# EAGLE design ESP8266_Single_RGB_RevB (EAGLE 9.6.2)
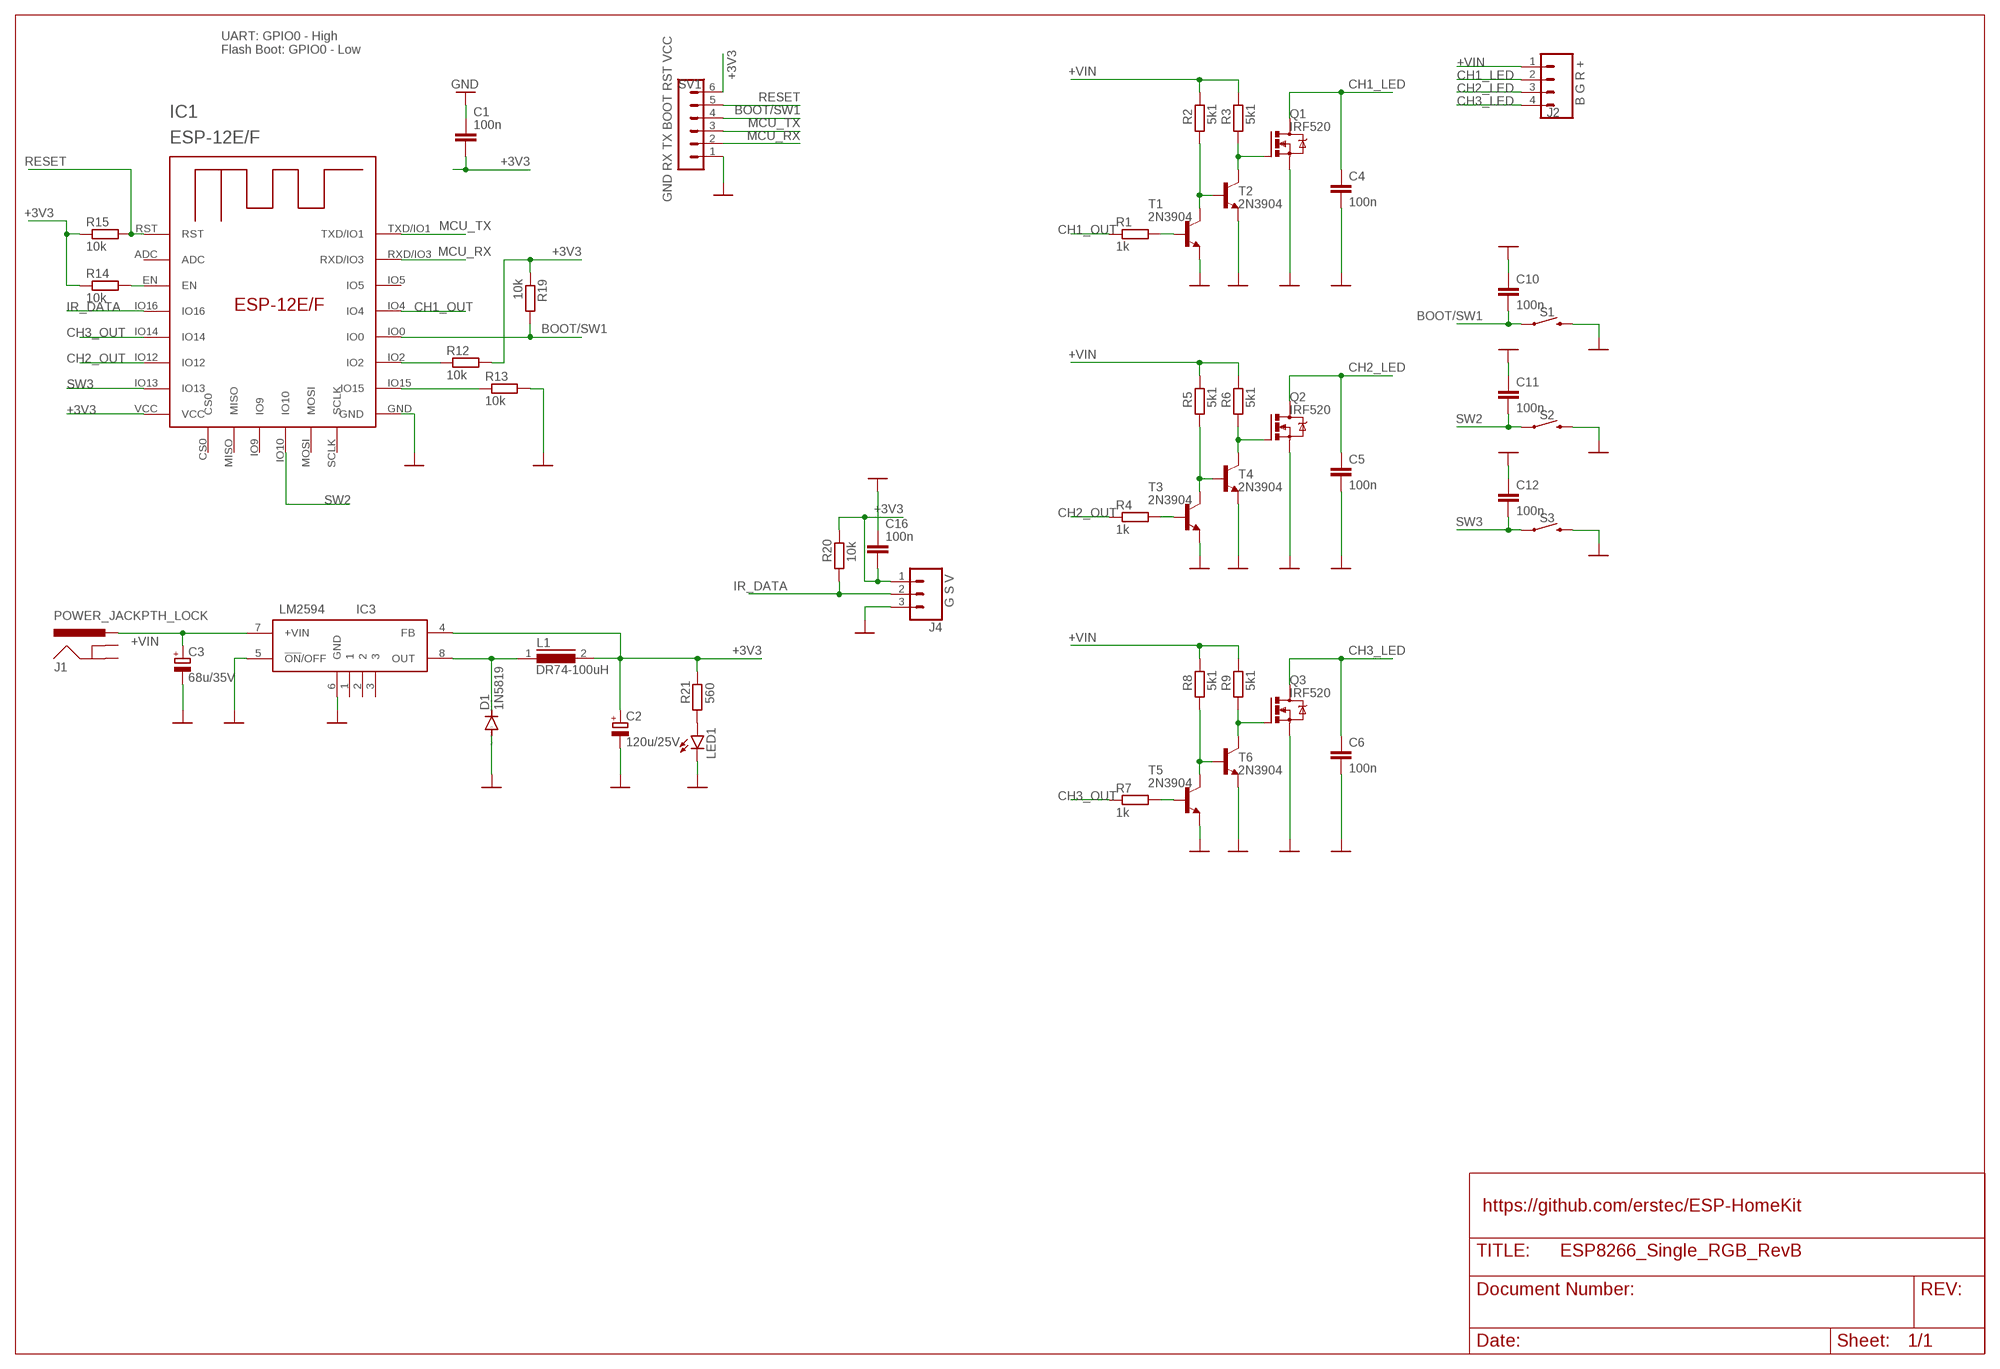
[diagram p0: schematic, sheet 1]

## Parts
C1  100n  C-EU050-024X044  [C050-024X044]
C2  120u/25V  CPOL-EUE2,5-6E  [E2,5-6E]
C3  68u/35V  CPOL-EUE2.5-6  [E2,5-6]
C4  100n  C-EU050-024X044  [C050-024X044]
C5  100n  C-EU050-024X044  [C050-024X044]
C6  100n  C-EU050-024X044  [C050-024X044]
C10  100n  C-EU050-024X044  [C050-024X044]
C11  100n  C-EU050-024X044  [C050-024X044]
C12  100n  C-EU050-024X044  [C050-024X044]
C16  100n  C-EU050-024X044  [C050-024X044]
D1  1N5819  DIODE-DO41-7.6  [DO41-7.6]
IC1  ESP-12E/F  [ESP-12E]
IC3  LM2594  [TSOP8]
J1  POWER_JACKPTH_LOCK  [POWER_JACK_PTH_LOCK]
J2  B G R +  CONN_04SCREW_LOCK  [SCREWTERMINAL-3.5MM-4_LOCK]
J4  G S V  CONN_03SCREW_LOCK  [SCREWTERMINAL-3.5MM-3_LOCK.007S]
L1  DR74-100uH  DR74  [DR74]
LED1  LED5MM  [LED5MM]
Q1  IRF520  [TO220BV]
Q2  IRF520  [TO220BV]
Q3  IRF520  [TO220BV]
R1  1k  R-EU_0204/7  [0204/7]
R2  5k1  R-EU_0204/7  [0204/7]
R3  5k1  R-EU_0204/7  [0204/7]
R4  1k  R-EU_0204/7  [0204/7]
R5  5k1  R-EU_0204/7  [0204/7]
R6  5k1  R-EU_0204/7  [0204/7]
R7  1k  R-EU_0204/7  [0204/7]
R8  5k1  R-EU_0204/7  [0204/7]
R9  5k1  R-EU_0204/7  [0204/7]
R12  10k  R-EU_0204/7  [0204/7]
R13  10k  R-EU_0204/7  [0204/7]
R14  10k  R-EU_0204/7  [0204/7]
R15  10k  R-EU_0204/7  [0204/7]
R19  10k  R-EU_0204/7  [0204/7]
R20  10k  R-EU_0204/7  [0204/7]
R21  560  R-EU_0204/7  [0204/7]
S1  MOMENTARY-SWITCH-SPST-PTH-6.0MM  [TACTILE_SWITCH_PTH_6.0MM]
S2  MOMENTARY-SWITCH-SPST-PTH-6.0MM  [TACTILE_SWITCH_PTH_6.0MM]
S3  MOMENTARY-SWITCH-SPST-PTH-6.0MM  [TACTILE_SWITCH_PTH_6.0MM]
SV1  GND RX TX BOOT RST VCC  MA06-1  [MA06-1]
T1  2N3904  2N3904-NPN-TO92-EBC  [TO92-EBC]
T2  2N3904  2N3904-NPN-TO92-EBC  [TO92-EBC]
T3  2N3904  2N3904-NPN-TO92-EBC  [TO92-EBC]
T4  2N3904  2N3904-NPN-TO92-EBC  [TO92-EBC]
T5  2N3904  2N3904-NPN-TO92-EBC  [TO92-EBC]
T6  2N3904  2N3904-NPN-TO92-EBC  [TO92-EBC]

## Nets
+3V3: C1.2 C2.+ C16.2 IC1.VCC IC3.4(FB) J4.1 L1.2 R12.2 R14.1 R15.1 R19.1 R20.2 R21.2 SV1.6
+VIN: C3.+ IC3.7(+VIN) J1.PWR J2.1 R2.2 R3.2 R5.2 R6.2 R8.2 R9.2
BOOT/SW1: C10.2 IC1.IO0 R19.2 S1.1 SV1.4
CH1_LED: C4.1 J2.2 Q1.D
CH1_OUT: IC1.IO4 R1.1
CH2_LED: C5.1 J2.3 Q2.D
CH2_OUT: IC1.IO12 R4.1
CH3_LED: C6.1 J2.4 Q3.D
CH3_OUT: IC1.IO14 R7.1
GND: C1.1 C2.- C3.- C4.2 C5.2 C6.2 C10.1 C11.1 C12.1 C16.1 D1.A IC1.GND IC3.5(!ON!/OFF) IC3.6(GND) J4.3 LED1.K(C) Q1.S Q2.S Q3.S R13.2 S1.3 S2.3 S3.3 SV1.1 T1.E T2.E T3.E T4.E T5.E T6.E
IR_DATA: IC1.IO16 J4.2 R20.1
MCU_RX: IC1.RXD/IO3 SV1.2
MCU_TX: IC1.TXD/IO1 SV1.3
N$1: R2.1 T1.C T2.B
N$2: R1.2 T1.B
N$3: LED1.A R21.1
N$4: Q1.G R3.1 T2.C
N$10: R5.1 T3.C T4.B
N$11: R4.2 T3.B
N$13: Q2.G R6.1 T4.C
N$15: D1.C IC3.8(OUT) L1.1
N$16: R8.1 T5.C T6.B
N$17: R7.2 T5.B
N$19: Q3.G R9.1 T6.C
N$71: IC1.IO2 R12.1
N$72: IC1.IO15 R13.1
N$74: IC1.EN R14.2
RESET: IC1.RST R15.2 SV1.5
SW2: C11.2 IC1.IO10 S2.1
SW3: C12.2 IC1.IO13 S3.1
Unconnected: IC1.ADC IC1.CS0 IC1.IO5 IC1.IO9 IC1.MISO IC1.MOSI IC1.SCLK IC3.1 IC3.2 IC3.3 J1.GND J1.GNDBREAK

## Notes on the sheet
- UART: GPIO0 - High
  Flash Boot: GPIO0 - Low
- https://github.com/erstec/ESP-HomeKit

## Library data of the parts
C1 C4-C6 C10-C12 C16 = rcl:C-EU: CAPACITOR, European symbol; SPICEPREFIX: C
C2 C3 = rcl:CPOL-EU: POLARIZED CAPACITOR, European symbol; SPICEPREFIX: C
D1 = diode:DIODE-: DIODE
IC1 = esp-12e-f:ESP-12E/F
IC3 = LM2594:LM2594: Power Converter 150kHz 0.5A Step-Down Voltage Regulator Check availability <https://pricing.snapeda.com/parts/LM2594/National%20Semiconductor/view-part?ref=eda>; AVAILABILITY: Not in stock; DESCRIPTION: Buck Switching Regulator IC Positive Adjustable 1.2V 1 Output 500mA 8-SOIC (0.154, 3.90mm Width); MF: National Semiconductor; MP: LM2594; PACKAGE: SOIC-8 National Semiconductor; PRICE: None
J1 = SparkFun-Connectors:POWER_JACK: Power Jack Connector This is the standard 5.5mm barrel jack for power. The PTH is the most common, proven, reliable, footprint. The Slot footprint only works if the mill layer is transmitted to the PCB fab house so be warned. Here are the connectors we sell at SparkFun: DC Barrel Power Jack/Connector <https://www.sparkfun.com/products/119> (PRT-00119) DC Barrel Power Jack/Connector (SMD) <https://www.sparkfun.com/products/12748> (PRT-12748) DC Barrel Jack Adapter - Breadboard Compatible <https://www.sparkfun.com/products/10811> (PRT-10811) It is used on this SparkFun product (and many, many others): SparkFun RedBoard - Programmed with Arduino <https://www.sparkfun.com/products/12757> (DEV-12757) Also, if you need a mating power supply or connector, please check these out: Wall Adapter Power Supply - 9VDC 650mA <https://www.sparkfun.com/products/298> (TOL-00298) DC Barrel Jack Adapter - Male <https://www.sparkfun.com/products/10287> (PRT-10287); PROD_ID: CONN-08197; SF_ID: PRT-00119
J2 = SparkFun-Connectors:CONN_04: Multi connection point. Often used as Generic Header-pin footprint for 0.1 inch spaced/style header connections On any of the 0.1 inch spaced packages, you can populate with these: Break Away Headers - Straight <https://www.sparkfun.com/products/116> (PRT-00116) Break Away Male Headers - Right Angle <https://www.sparkfun.com/products/553> (PRT-00553) Female Headers <https://www.sparkfun.com/products/115> (PRT-00115) Break Away Headers - Machine Pin <https://www.sparkfun.com/products/117> (PRT-00117) Break Away Female Headers - Swiss Machine Pin <https://www.sparkfun.com/products/743> (PRT-00743) For SCREWTERMINALS and SPRING TERMINALS visit here: Screw Terimnals on SparkFun.com <https://www.sparkfun.com/search/results?term=Screw+Terminals> (5mm/3.5mm/2.54mm spacing) This device is also useful as a general connection point to wire up your design to another part of your project. Our various solder wires solder well into these plated through hole pads. Hook-Up Wire - Assortment (Stranded, 22 AWG) <https://www.sparkfun.com/products/11375> (PRT-11375) Hook-Up Wire - Assortment (Solid Core, 22 AWG) <https://www.sparkfun.com/products/11367> (PRT-11367) View the entire wire category on our website here <https://www.sparkfun.com/categories/141> Special notes: Molex polarized connector foot print use with SKU : PRT-08231 with associated crimp pins and housings. 1MM SMD Version SKU: PRT-10208
J4 = SparkFun-Connectors:CONN_03: Multi connection point. Often used as Generic Header-pin footprint for 0.1 inch spaced/style header connections On any of the 0.1 inch spaced packages, you can populate with these: Break Away Headers - Straight <https://www.sparkfun.com/products/116> (PRT-00116) Break Away Male Headers - Right Angle <https://www.sparkfun.com/products/553> (PRT-00553) Female Headers <https://www.sparkfun.com/products/115> (PRT-00115) Break Away Headers - Machine Pin <https://www.sparkfun.com/products/117> (PRT-00117) Break Away Female Headers - Swiss Machine Pin <https://www.sparkfun.com/products/743> (PRT-00743) Stackable Header - 3 Pin (Female, 0.1") <https://www.sparkfun.com/products/13875> (PRT-13875) For SCREWTERMINALS and SPRING TERMINALS visit here: Screw Terimnals on SparkFun.com <https://www.sparkfun.com/search/results?term=Screw+Terminals> (5mm/3.5mm/2.54mm spacing) This device is also useful as a general connection point to wire up your design to another part of your project. Our various solder wires solder well into these plated through hole pads. Hook-Up Wire - Assortment (Stranded, 22 AWG) <https://www.sparkfun.com/products/11375> (PRT-11375) Hook-Up Wire - Assortment (Solid Core, 22 AWG) <https://www.sparkfun.com/products/11367> (PRT-11367) View the entire wire category on our website here <https://www.sparkfun.com/categories/141> Special notes: Molex polarized connector foot print use with SKU : PRT-08232 with associated crimp pins and housings.; PROD_ID: CONN-08288; SF_ID: PRT-08235
L1 = inductors:DR74: High Power Density, High Efficiency, Shielded Inductors Source: coiltronics_dr_series.pdf
LED1 = led:LED: LED OSRAM: - CHIPLED LG R971, LG N971, LY N971, LG Q971, LY Q971, LO R971, LY R971 LH N974, LH R974 LS Q976, LO Q976, LY Q976 LO Q996 - Hyper CHIPLED LW Q18S LB Q993, LB Q99A, LB R99A - SideLED LS A670, LO A670, LY A670, LG A670, LP A670 LB A673, LV A673, LT A673, LW A673 LH A674 LY A675 LS A676, LA A676, LO A676, LY A676, LW A676 LS A679, LY A679, LG A679 - Hyper Micro SIDELED® LS Y876, LA Y876, LO Y876, LY Y876 LT Y87S - SmartLED LW L88C, LW L88S LB L89C, LB L89S, LG L890 LS L89K, LO L89K, LY L89K LS L896, LA L896, LO L896, LY L896 - TOPLED LS T670, LO T670, LY T670, LG T670, LP T670 LSG T670, LSP T670, LSY T670, LOP T670, LYG T670 LG T671, LOG T671, LSG T671 LB T673, LV T673, LT T673, LW T673 LH T674 LS T676, LA T676, LO T676, LY T676, LB T676, LH T676, LSB T676, LW T676 LB T67C, LV T67C, LT T67C, LS T67K, LO T67K, LY T67K, LW E67C LS E67B, LA E67B, LO E67B, LY E67B, LB E67C, LV E67C, LT E67C LW T67C LS T679, LY T679, LG T679 LS T770, LO T770, LY T770, LG T770, LP T770 LB T773, LV T773, LT T773, LW T773 LH T774 LS E675, LA E675, LY E675, LS T675 LS T776, LA T776, LO T776, LY T776, LB T776 LHGB T686 LT T68C, LB T68C - Hyper Mini TOPLED® LB M676 - Mini TOPLED Santana® LG M470 LS M47K, LO M47K, LY M47K Source: http://www.osram.convergy.de LUXEON: - LUMILED® LXK2-PW12-R00, LXK2-PW12-S00, LXK2-PW14-U00, LXK2-PW14-V00 LXK2-PM12-R00, LXK2-PM12-S00, LXK2-PM14-U00 LXK2-PE12-Q00, LXK2-PE12-R00, LXK2-PE12-S00, LXK2-PE14-T00, LXK2-PE14-U00 LXK2-PB12-K00, LXK2-PB12-L00, LXK2-PB12-M00, LXK2-PB14-N00, LXK2-PB14-P00, LXK2-PB14-Q00 LXK2-PR12-L00, LXK2-PR12-M00, LXK2-PR14-Q00, LXK2-PR14-R00 LXK2-PD12-Q00, LXK2-PD12-R00, LXK2-PD12-S00 LXK2-PH12-R00, LXK2-PH12-S00 LXK2-PL12-P00, LXK2-PL12-Q00, LXK2-PL12-R00 Source: www.luxeon.com KINGBRIGHT: KA-3528ASYC Source: www.kingbright.com
Q1-Q3 = transistor-power:IRF520: HEXFET Power MOSFET
R1-R9 R12-R15 R19-R21 = rcl:R-EU_: RESISTOR, European symbol; SPICEPREFIX: R
S1-S3 = SparkFun-Switches:MOMENTARY-SWITCH-SPST: Momentary Switch (Pushbutton) - SPST Normally-open (NO) SPST momentary switches (buttons, pushbuttons). Variants PTH-12MM - 12mm square, through-hole Momentary Pushbutton Switch - 12mm Square <https://www.sparkfun.com/products/9190> (COM-09190) PTH-6.0MM, PTH-6.0MM-KIT - 6.0mm square, through-hole Mini Pushbutton Switch <https://www.sparkfun.com/products/97> (COM-00097) KIT package intended for soldering kit's - only one side of pads' copper is exposed. PTH-RIGHT-ANGLE-KIT - Right-angle, through-hole Right Angle Tactile Button <https://www.sparkfun.com/products/10791> - Used on SparkFun BigTime Watch Kit <https://www.sparkfun.com/products/11734> SMD-12MM - 12mm square, surface-mount Tactile Button - SMD (12mm) <https://www.sparkfun.com/products/12993> (COM-12993) Used on SparkFun PicoBoard <https://www.sparkfun.com/products/11888> SMD-4.5MM - 4.5mm Square Trackball Switch Used on SparkFun Blackberry Trackballer Breakout <https://www.sparkfun.com/products/13169> SMD-4.6MMX2.8MM - 4.60mm x 2.80mm, surface mount Used on SparkFun Pro Micro - RP2040 <https://www.sparkfun.com/products/17717> SMD-5.2MM, SMD-5.2-REDUNDANT - 5.2mm square, surface-mount Mini Pushbutton Switch - SMD <https://www.sparkfun.com/products/8720> (COM-08720) Used on Arduino Pro Mini <https://www.sparkfun.com/products/11114> REDUNDANT package connects both switch circuits together SMD-6.0X3.5MM - 6.0 x 3.5mm, surface mount Momentary Reset Switch SMD <https://www.sparkfun.com/products/8229> (COM-08229) SMD-6.2MM-TALL - 6.2mm square, surface mount Tactile Button - SMD (6mm) <https://www.sparkfun.com/products/12992> Used on SparkFun Digital Sandbox <https://www.sparkfun.com/products/12651> SMD-RIGHT-ANGLE - Right-angle, surface mount Used on SparkFun Block for Intel® Edison - Arduino <https://www.sparkfun.com/products/13036>; PROD_ID: SWCH-08441; SF_SKU: COM-00097
SV1 = con-lstb:MA06-1: PIN HEADER; OC_FARNELL: unknown; OC_NEWARK: unknown
T1-T6 = transistor-neu-to92:*-NPN-: NPN Transistror

## Board
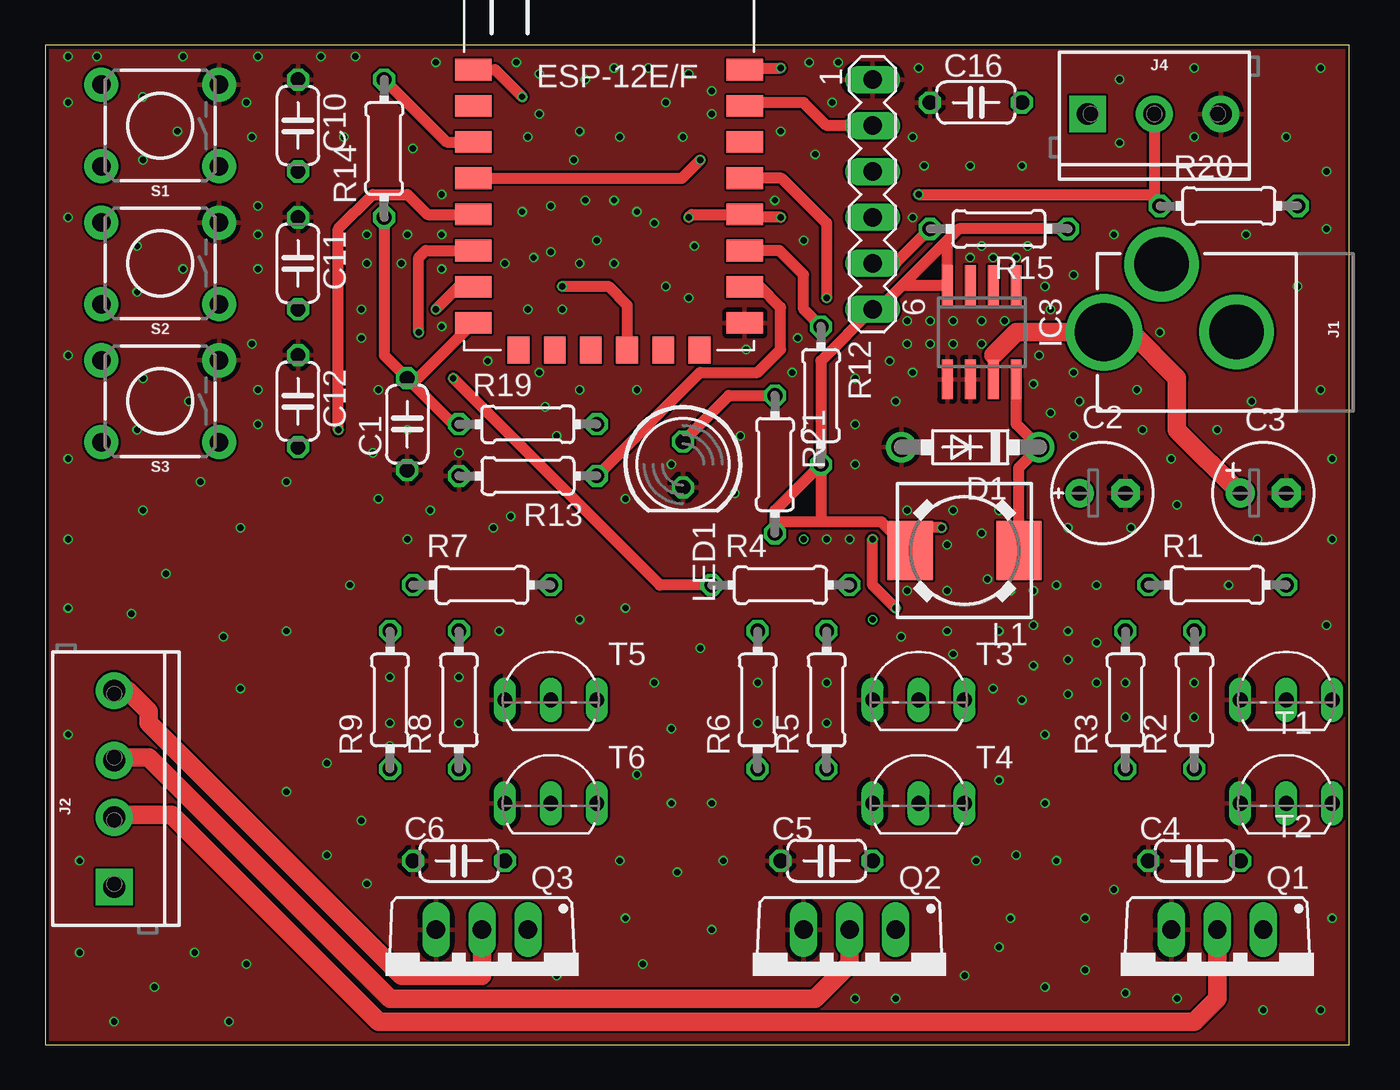
[diagram p1: board, top side]
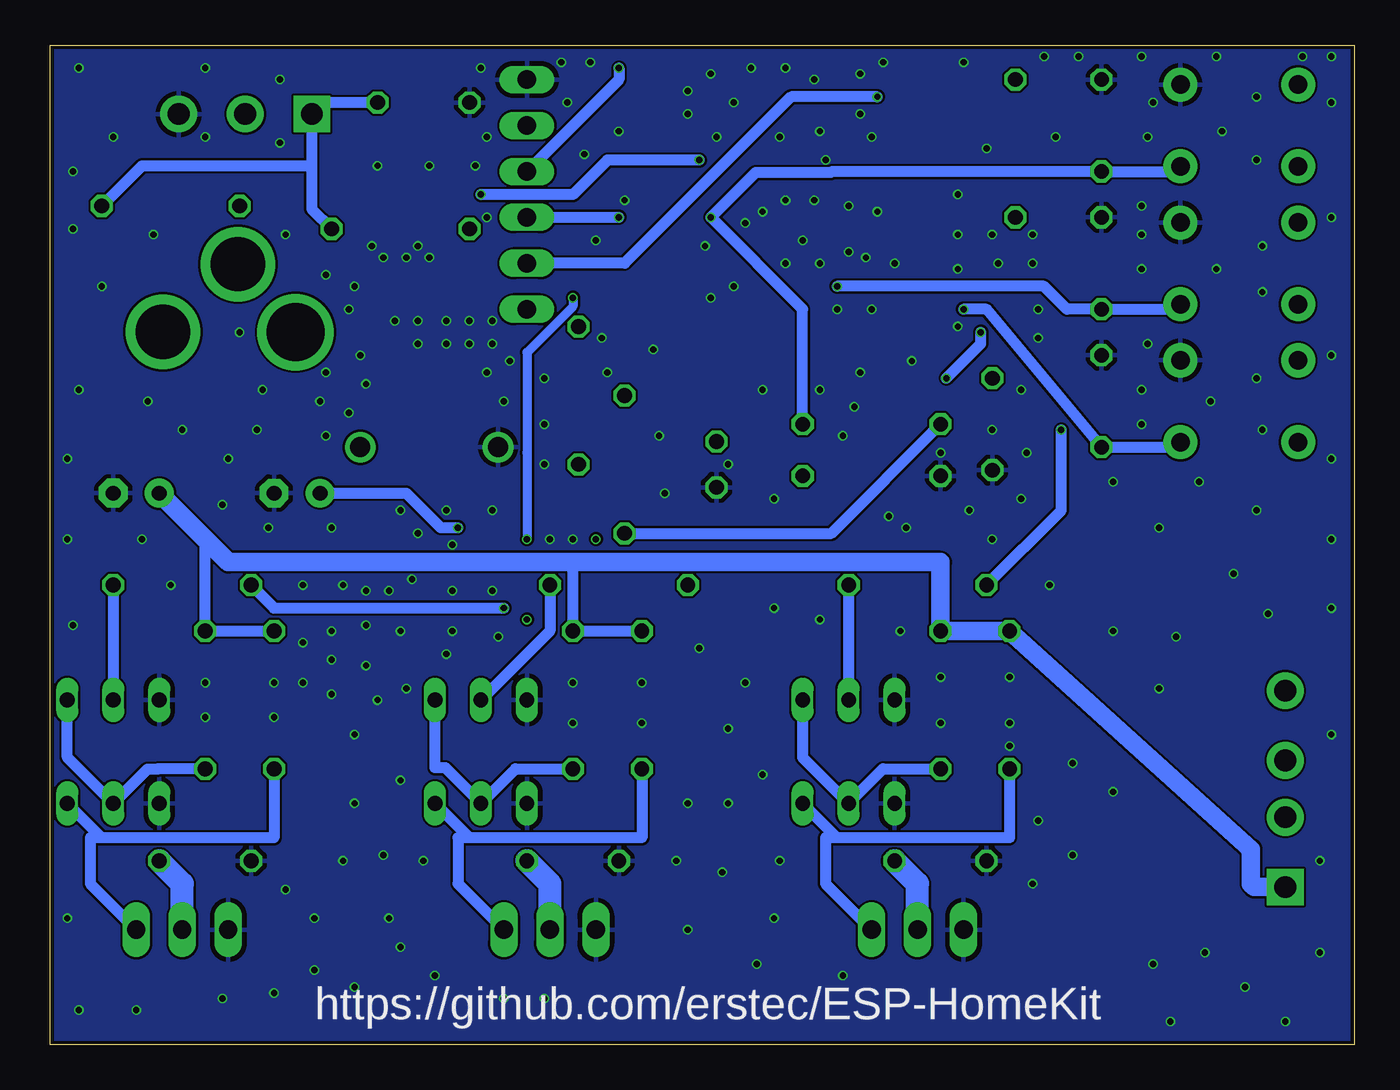
[diagram p2: board, bottom side, seen from below]

Size 72.06 x 55.23 mm. Coordinates in mm from the lower left corner, seen from the top.
Outline: 0,0 72.06,0 72.06,55.23 0,55.23 0,0
Copper layers (1*16): Top 0.035559375mm / dielectric 1.6mm / Bottom 0.035559375mm
Design rules "jlcpcb-2layers": minimum track width 5mil, minimum drill 12mil, track to track 5mil, track to pad 5mil, pad to pad 5mil, via to via 5mil, smd to smd 5mil, copper to edge 8mil, drill to drill 6mil, minimum pad ring 5mil, minimum via ring 3mil, stop-mask expansion 2.5mil, vias tented up to drill 0mil, thermal gap 10mil

### Footprints (pad centres in the part's own frame; a part is rotated, then mirrored left to right if it is on the bottom)
C050-024X044 = drill 0.813 octagon: 1 -2.54,0; 2 2.54,0
E2,5-6E = drill 0.813 pad 1.575: + -1.27,0 | drill 0.813 pad 1.575 octagon: - 1.27,0
E2,5-6 = drill 0.813 pad 1.6: + -1.27,0 | drill 0.813 pad 1.6 octagon: - 1.27,0
DO41-7.6 = drill 1.1 pad 1.7: A 3.81,0; C -3.81,0
ESP-12E = smd 2 x 1.2: ADC -7.46,5.53; EN -7.46,3.53; GND 7.54,-6.47; IO0 7.54,-0.47; IO2 7.54,-2.47; IO4 7.54,1.53; IO5 7.54,3.53; IO12 -7.46,-2.47; IO13 -7.46,-4.47; IO14 -7.46,-0.47; IO15 7.54,-4.47; IO16 -7.46,1.53; RST -7.46,7.53; RXD/IO3 7.54,5.53; TXD/IO1 7.54,7.53; VCC -7.46,-6.47 | smd 1.2 x 1.5: CS0 -4.96,-7.97; IO9 -0.96,-7.97; IO10 1.04,-7.97; MISO -2.96,-7.97; MOSI 3.04,-7.97; SCLK 5.04,-7.97
TSOP8 = smd 0.6 x 2.2: 1 -1.905,-2.6; 2 -0.635,-2.6; 3 0.635,-2.6; 4 1.905,-2.6; 5 1.905,2.6; 6 0.635,2.6; 7 -0.635,2.6; 8 -1.905,2.6
POWER_JACK_PTH_LOCK = drill 2.997 pad 4.115: GND 0.025,6.557; GNDBREAK 3.762,10.7 | drill 3.2 pad 4.115: PWR 0,13.878
SCREWTERMINAL-3.5MM-4_LOCK = drill 1.2 pad 2.032 square: 1 -0.178,0 | drill 1.2 pad 2.032: 2 3.678,0; 3 6.822,0; 4 10.678,0
SCREWTERMINAL-3.5MM-3_LOCK.007S = drill 1.2 pad 2.032 square: 1 -0.178,0 | drill 1.2 pad 2.032: 2 3.5,0; 3 7.178,0
DR74 = smd 2.5 x 3.25: 1 -3,0; 2 3,0
LED5MM = drill 0.813 octagon: A -1.27,0; K 1.27,0
TO220BV = drill 1.016 long: D 0,-2.54; G -2.54,-2.54; S 2.54,-2.54
0204/7 = drill 0.813 octagon: 1 -3.81,0; 2 3.81,0
TACTILE_SWITCH_PTH_6.0MM = drill 1.016 pad 1.88: 1 -3.251,2.261; 2 3.251,2.261; 3 -3.251,-2.261; 4 3.251,-2.261
MA06-1 = drill 1.016 long: 1 -6.35,0; 2 -3.81,0; 3 -1.27,0; 4 1.27,0; 5 3.81,0; 6 6.35,0
TO92-EBC = drill 0.813 long: B 0,-1.27; C 2.54,-1.27; E -2.54,-1.27

### Placement (x,y rotation side)
C1  20,34.29 90 top
C2  58.42,30.48 0 top
C3  67.31,30.48 0 top
C4  63.5,10.16 180 top
C5  43.18,10.16 180 top
C6  22.86,10.16 180 top
C10  13.97,50.8 270 top
C11  13.97,43.18 270 top
C12  13.97,35.56 270 top
C16  51.44,52.07 0 top
D1  51.12,33.02 180 top
IC1  31.11,46.35 0 top
IC3  51.75,39.37 180 top
J1  72.39,39.37 90 top
J2  3.81,8.89 90 top
J4  57.78,51.44 0 top
L1  50.8,27.3 180 top
LED1  35.24,32.07 270 top
Q1  64.77,3.81 180 top
Q2  44.45,3.81 180 top
Q3  24.13,3.81 180 top
R1  64.77,25.4 0 top
R2  63.5,19.05 90 top
R3  59.69,19.05 90 top
R4  40.64,25.4 0 top
R5  43.18,19.05 90 top
R6  39.37,19.05 90 top
R7  24.13,25.4 0 top
R8  22.86,19.05 90 top
R9  19.05,19.05 90 top
R12  42.86,35.88 270 top
R13  26.67,31.43 180 top
R14  18.73,49.53 90 top
R15  52.7,45.09 180 top
R19  26.67,34.29 0 top
R20  65.41,46.35 0 top
R21  40.32,32.07 270 top
S1  6.35,50.8 180 top
S2  6.35,43.18 180 top
S3  6.35,35.56 180 top
SV1  45.72,46.99 270 top
T1  68.58,20.32 0 top
T2  68.58,14.61 0 top
T3  48.26,20.32 0 top
T4  48.26,14.61 0 top
T5  27.94,20.32 0 top
T6  27.94,14.61 0 top

### Tracks (layer width: path | path; a pad name or v marks a point on that pad's centre or on a via)
+3V3  (via drill 0.35)
  Top 0.61: R15.1 50.48,45.09 49.85,44.45 | 47.37,41.97 46.04,40.64 SV1.6 42.86,37.78 R12.2 | R21.2 40.32,28.89 | 40.32,28.89 40.32,29.53 R12.2 | R19.1 22.54,34.29 C1.2 | C1.2 20.6,36.83 IC1.VCC | R14.1 18.73,38.1 C1.2 | L1.2 47.71,27.39 | 47.71,27.39 46.21,28.89 42.86,28.89 | R12.2 42.86,28.89 | v49.53,28.57 48.9,28.57 47.71,27.39 | 42.86,28.89 40.32,28.89 | 47.37,41.97 IC3.4 49.85,44.45 | 49.85,44.45 47.37,41.97
  Bottom 0.61: C16.2 56.97,52.07 J4.1 57.61,48.58 | 57.61,48.58 57.61,46.18 R15.1 | R20.2 66.99,48.58 57.61,48.58 | R21.2 28.89,28.26 R19.1 | C2.+ 52.39,30.48 50.48,28.57 v49.53,28.57
+VIN
  Top 0.61: 52.39,38.1 IC3.7
  Top 1.016: C3.+ 62.55,33.97 62.55,36.83 60.01,39.37 J1.PWR 53.66,39.37 52.39,38.1
  Bottom 0.61: R6.2 R5.2 43.18,26.67 | R3.2 R2.2 63.5,27.94
  Bottom 1.016: J2.1 5.54,8.71 5.71,8.89 5.71,10.79 R9.2 R8.2 22.86,26.67 43.18,26.67 62.23,26.67 63.5,27.94 C3.+
BOOT/SW1  (via drill 0.35)
  Top 0.61: v35.56,45.72 35.73,45.88 IC1.IO0 38.82,45.72 v40.64,45.72
  Bottom 0.61: S1.1 9.88,48.26 C10.2 28.86,48.26 28.92,48.2 33.08,48.2 v35.56,45.72 30.48,40.64 R19.2 | SV1.4 v40.64,45.72
CH1_LED
  Top 1.016: Q1.D 64.77,2.54 63.5,1.27 18.41,1.27 6.99,12.7 3.94,12.7 J2.2
  Bottom 1.27: Q1.D 64.77,8.89 C4.1
CH1_OUT  (via drill 0.35)
  Top 0.61: IC1.IO4 40.7,47.88 43.18,45.4 v43.18,41.27 | v46.99,24.13 45.72,25.4 v45.72,27.94
  Bottom 0.508: v43.18,41.27 43.18,40.8 45.72,38.26 45.72,32.7 v45.72,27.94
  Bottom 0.61: R1.1 59.69,24.13 v46.99,24.13
CH2_LED
  Top 1.016: Q2.D 44.45,4.45 42.55,2.54 19.05,2.54 5.71,15.88 3.97,15.88 J2.3
  Bottom 1.27: Q2.D 44.45,8.89 C5.1
CH2_OUT  (via drill 0.35)
  Top 0.61: IC1.IO12 21.02,43.88 20.64,43.5 v20.64,39.37 | v22.54,36.83 33.97,25.4 R4.1
  Bottom 0.61: v22.54,36.83 20.64,38.73 v20.64,39.37
CH3_LED
  Top 1.016: Q3.D 24.13,3.81 19.68,3.81 5.71,17.78 5.71,18.41 4.56,19.57 J2.4
  Bottom 1.27: Q3.D 24.13,8.89 C6.1
CH3_OUT  (via drill 0.35)
  Top 0.61: IC1.IO14 21.12,45.88 20.02,46.99 18.1,46.99 16.19,45.09 v16.19,33.97
  Bottom 0.61: R7.1 16.19,29.53 v16.19,33.97
GND  (via drill 0.35)
  other vias: 61.59,39.37 50.16,40.01 51.75,40.01 53.02,40.01 51.75,38.73 50.16,38.73 48.9,40.01 48.9,38.73 47.62,38.73 47.62,40.01 46.67,37.78 47.94,37.15 46.99,35.56 44.77,36.83 44.77,34.29 44.77,32.07 54.93,38.1 56.83,37.15 57.15,35.56 54.61,36.51 55.56,34.92 56.83,33.66 60.64,33.97 64.77,33.97 48.58,48.58 51.12,48.58 53.98,48.58 59.37,49.85 59.37,53.34 63.5,50.16 70.8,48.26 70.8,45.09 66.36,44.77 59.05,44.77 56.83,42.55 55.24,41.91 55.56,40.64 51.75,44.13 54.29,44.13 50.16,29.53 51.75,28.26 49.85,27.62 47.62,29.53 52.7,29.53 52.07,25.72 49.85,25.08 47.62,25.08 53.34,25.08 54.61,23.18 52.7,22.86 49.85,22.86 47.31,22.54 50.16,21.59 52.39,19.68 56.52,21.27 56.52,19.37 57.47,6.99 59.05,8.57 57.47,4.13 52.7,5.4 32.07,6.99 34.61,13.34 34.61,17.46 33.66,20 36.2,21.91 32.07,24.13 29.53,23.5 25.08,22.86 16.83,25.4 10.79,28.57 5.4,29.53 6.67,26.04 9.84,22.54 4.76,23.81 11.11,4.45 6.03,3.17 15.56,10.48 13.34,13.97 15.56,15.56 17.46,12.38 17.78,8.89 36.83,13.34 32.7,14.92 53.66,10.48 59.69,2.86 46.99,2.54 44.77,2.54 28.26,3.81 62.55,2.54 70.8,23.18 71.12,27.94 62.55,29.84 56.52,28.57 60.01,28.57 66.99,27.94 55.88,25.4 44.45,27.94 43.18,27.94 41.91,44.45 40.32,46.67 41.59,39.05 41.27,37.15 40.64,50.48 42.55,49.21 43.5,52.07 42.23,54.29 43.81,54.29 48.26,53.98 47.94,50.16 47.94,45.72 51.12,43.5 52.39,43.5 53.66,43.5 68.58,50.16 63.5,53.98 70.48,53.98 69.22,41.91 66.67,35.56 70.48,36.2 71.12,32.38 60.33,36.2 62.23,32.38 65.41,25.4 54.61,20.95 53.98,19.05 55.24,17.14 55.24,13.34 52.7,14.61 54.61,25.08 71.12,6.99 70.48,1.91 67.31,1.91 55.88,10.16 53.34,6.99 55.24,3.17 51.44,10.16 50.8,3.81 37.47,10.16 34.92,9.53 31.75,10.16 33.02,4.45 36.83,6.35 19.05,16.51 10.79,19.68 13.34,22.86 27.3,51.44 21.59,54.29 20.32,49.53 21.91,46.99 20,44.77 19.68,43.18 17.78,44.77 17.78,43.18 17.46,40.64 17.46,39.05 18.41,36.2 20,33.97 18.1,32.7 18.41,30.16 20,27.94 21.27,29.53 24.77,28.57 25.72,29.21 22.86,32.7 21.91,42.86 21.91,44.77 21.91,39.69 24.45,37.78 27.3,37.15 29.53,36.2 27.62,35.24 28.26,33.66 32.7,36.2 30.48,44.45 26.67,50.16 29.53,50.48 26.35,46.04 26.99,43.5 31.43,43.18 33.66,45.4 29.84,46.67 31.43,46.67 35.24,50.16 35.56,53.66 33.34,53.98 31.43,53.98 26.04,54.29 17.14,54.61 15.24,54.61 11.75,54.61 11.11,52.07 11.43,50.16 11.75,46.35 11.75,44.77 11.75,42.86 11.43,38.73 11.75,36.2 11.75,34.29 13.34,31.11 8.57,31.11 38.42,33.66 38.1,30.48 34.61,32.07 32.07,30.16 38.73,38.42 35.88,44.13 29.53,43.18 1.27,38.1 1.27,32.38 1.27,45.72 1.27,52.07 27.3,53.66 29.84,53.34 31.75,50.16 34.29,52.07 36.83,52.7 36.83,51.44 29.21,48.9 27.94,46.35 32.7,46.04 25.4,43.18 26.67,40.64 28.57,40.64 27.94,43.81 34.29,41.91 35.56,41.27 16.51,50.16 1.27,27.94 1.27,24.13 1.27,17.14 1.91,10.16 1.91,5.08 3.81,1.27 10.16,1.27 8.26,5.08 7.62,54.61 2.86,54.61 1.27,54.61 5.4,52.39 7.3,50.48 5.4,48.9 5.08,44.13 7.62,42.86 5.08,41.59 7.94,35.56 5.4,36.83 5.08,33.97 58.1,25.4 56.52,22.86 58.1,22.23 58.1,20 59.69,20 63.5,20 63.5,18.1 59.69,18.1 43.18,20 43.18,17.78 39.37,17.78 39.37,20 22.86,20.32 19.05,20.32 19.05,17.78 22.86,17.78
  pour Top: 0,55.24 72.39,55.24 72.39,0 0,0
  pour Bottom (rank 6): 0,55.24 72.39,55.24 72.39,0 0,0
IR_DATA  (via drill 0.35)
  Top 0.61: IC1.IO16 35.19,47.88 v36.2,48.9 | J4.2 61.28,46.99 | 61.28,46.99 61.28,46.66 R20.1 | v48.26,46.99 61.28,46.99
  Bottom 0.61: v36.2,48.9 41.27,48.9 43.18,46.99 v48.26,46.99
MCU_RX
  Top 0.61: SV1.2 43.18,50.8 41.91,52.07 38.84,52.07 IC1.RXD/IO3
MCU_TX  (via drill 0.35)
  Top 0.61: IC1.TXD/IO1 38.74,53.98 v40.64,53.98
  Bottom 0.61: v40.64,53.98 40.64,53.34 SV1.3
N$1
  Bottom 0.61: R2.1 66.1,15.24 66.11,15.22 66.69,15.22 T2.B 71.12,15.88 T1.C
N$2
  Bottom 0.61: R1.2 T1.B
N$3
  Top 0.61: LED1.A 37.78,35.88 R21.1
N$4
  Bottom 0.61: T2.C 69.22,11.43 | Q1.G 69.85,8.89 69.85,11.43 69.22,11.43 | R3.1 59.69,11.43 69.22,11.43
N$10
  Bottom 0.61: T4.B | T3.C 50.8,15.3 50.23,15.3 T4.B | R5.1 46.35,15.24 T4.B
N$11
  Bottom 0.61: R4.2 44.45,22.86 T3.B
N$13
  Bottom 0.61: T4.C 48.9,11.43 | Q2.G 49.53,8.89 49.53,11.43 48.9,11.43 | R6.1 39.37,11.43 48.9,11.43
N$15
  Top 0.61: IC3.8 53.66,34.29 D1.C 53.8,31.89 L1.1
N$16
  Bottom 0.61: T5.C 30.48,15.88 T6.B 26.04,15.24 R8.1
N$17
  Bottom 0.61: R7.2 T5.B
N$19
  Bottom 0.61: T6.C 28.57,11.43 | Q3.G 29.21,8.89 29.21,11.43 28.57,11.43 | R9.1 19.05,11.43 28.57,11.43
N$71
  Top 0.61: R12.1 41.91,40.64 41.91,42.55 40.57,43.88 IC1.IO2
N$72
  Top 0.61: R13.1 36.2,37.15 39.37,37.15 40.64,38.42 40.64,40.75 39.5,41.88 IC1.IO15
N$74
  Top 0.61: R14.2 22.19,49.88 IC1.EN
N$141  (via drill 0.35)
  other vias: 41.91,27.94
N$144  (via drill 0.35)
  other vias: 45.72,23.5
RESET  (via drill 0.35)
  Top 0.61: R15.2 46.99,43.18 SV1.5 | IC1.RST 24.86,53.88 v26.35,52.39
  Bottom 0.61: v26.35,52.39 31.11,52.39 40.32,43.18 SV1.5
SW2  (via drill 0.35)
  Top 0.61: v28.57,41.91 31.11,41.91 32.16,40.87 IC1.IO10
  Bottom 0.61: v28.57,41.91 17.14,41.91 15.88,40.64 C11.2 9.88,40.64 S2.1
SW3  (via drill 0.35)
  Top 0.61: v21.59,40.64 22.84,41.88 IC1.IO13
  Bottom 0.61: v21.59,40.64 20.32,40.64 C12.2 9.88,33.02 S3.1

### Text on the board
bNames: https://github.com/erstec/ESP-HomeKit